# Altium schematic sheet Bus-switch.SchDoc
size B
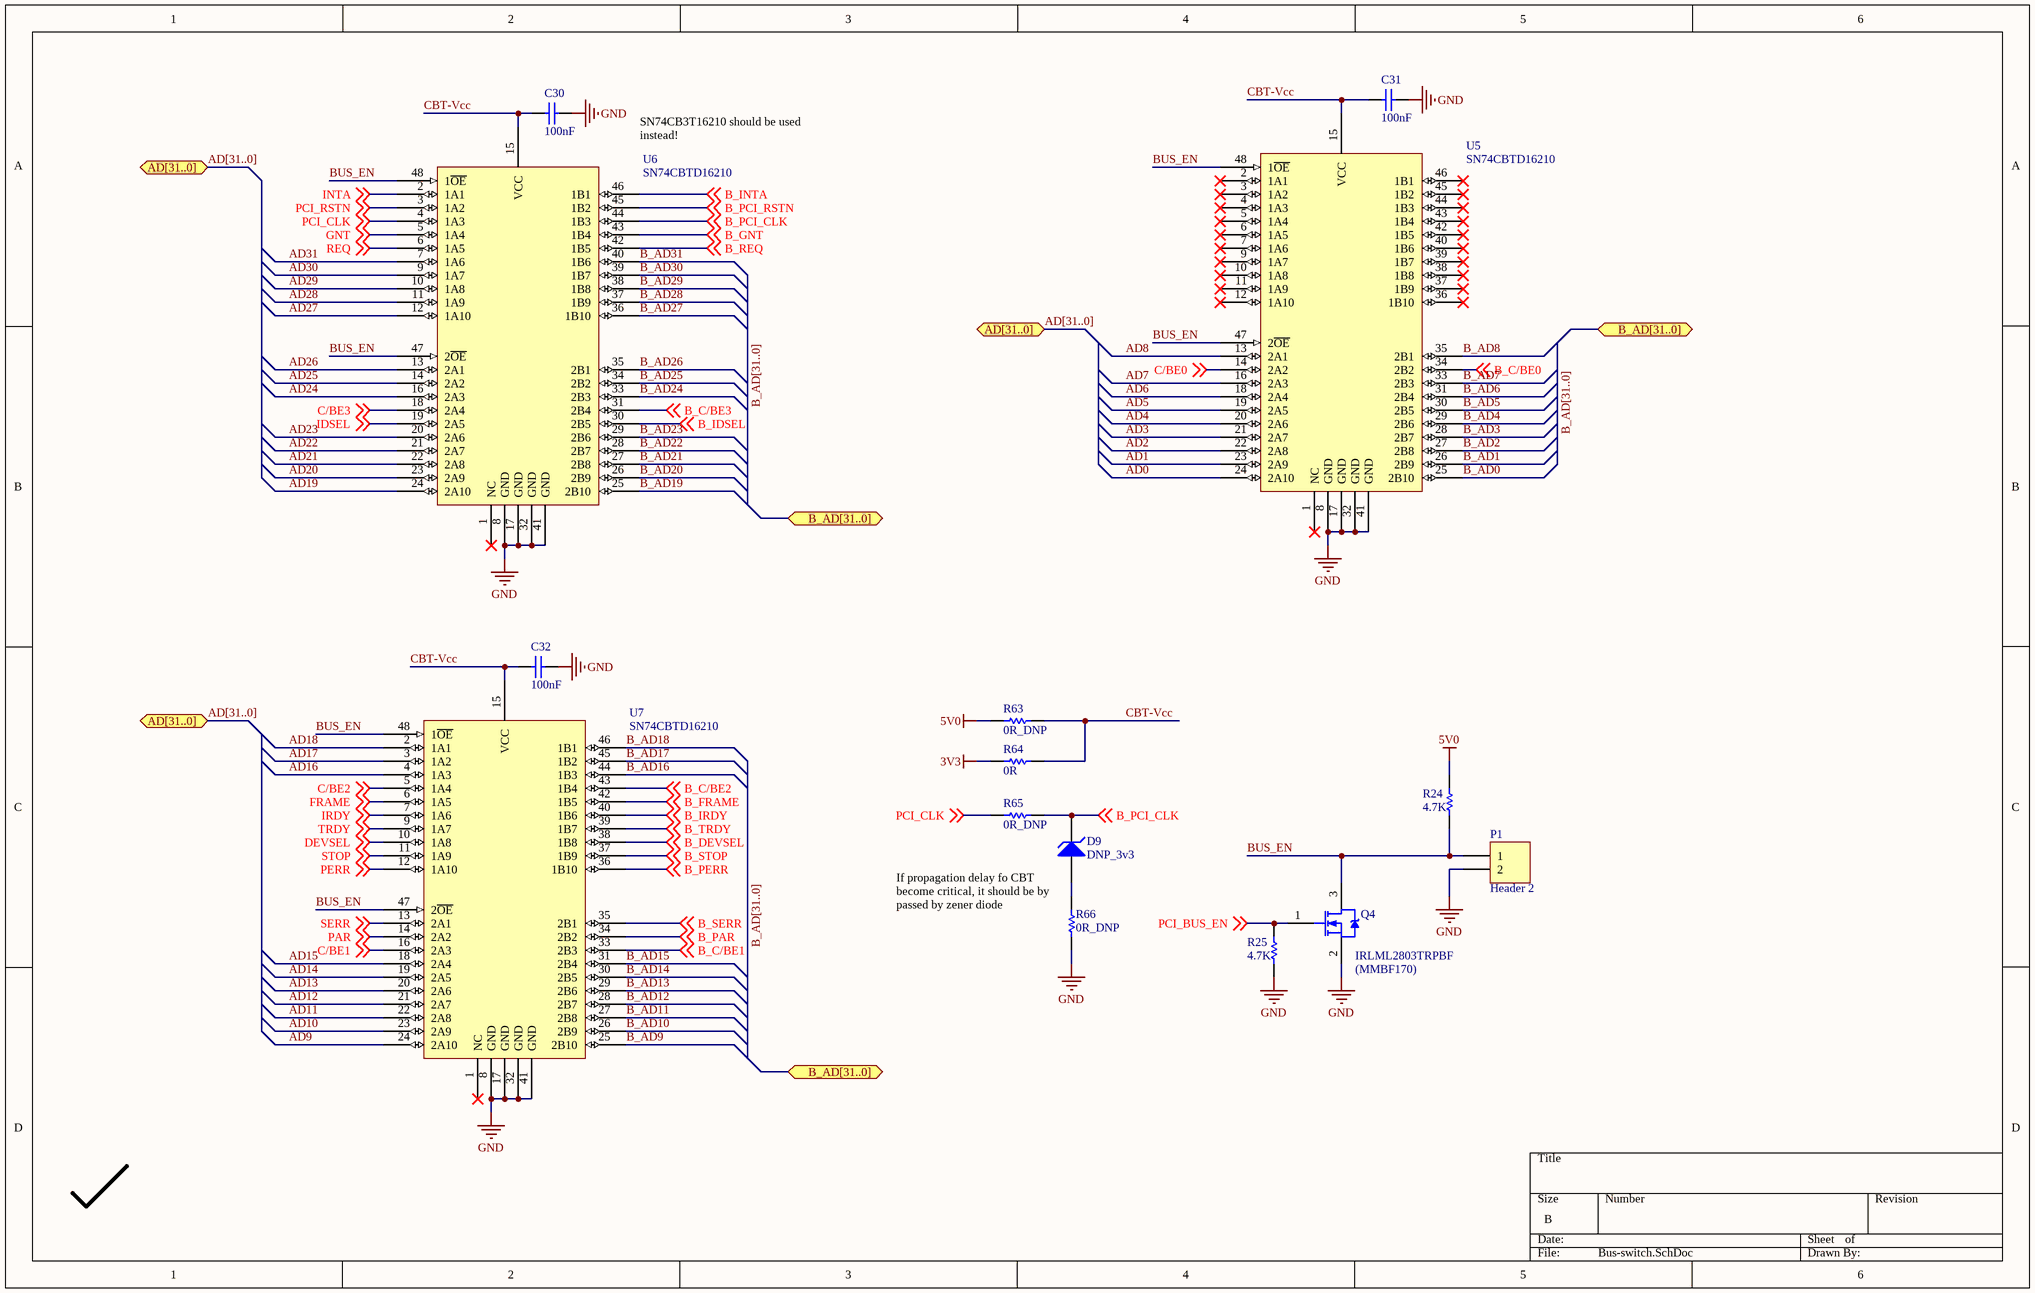
[diagram p0: Bus-switch.SchDoc]

## Parts
C30  value 100nF  [0603PKG]  (hidden comment: Cap Semi)
C31  value 100nF  [0603PKG]  (hidden comment: Cap Semi)
C32  value 100nF  [0603PKG]  (hidden comment: Cap Semi)
D9  DNP_3v3  [C1206]
P1  Header 2  [HDR1X2]
Q4  IRLML2803TRPBF  [SOT23]
R24  value 4.7K  [0603PKG]  (hidden comment: Res1)
R25  value 4.7K  [0603PKG]  (hidden comment: Res1)
R63  value 0R_DNP  [0603PKG]  (hidden comment: Res1)
R64  value 0R  [0603PKG]  (hidden comment: Res1)
R65  value 0R_DNP  [0603PKG]  (hidden comment: Res1)
R66  value 0R_DNP  [0603PKG]  (hidden comment: Res1)
U5  SN74CBTD16210  [TSSOP-48-DGG]
U6  SN74CBTD16210  [TSSOP-48-DGG]
U7  SN74CBTD16210  [TSSOP-48-DGG]

## Ports
AD[31..0], B_AD[31..0]

## Nets
3V3: R64.2
5V0: R24.2 R63.2
GND: C30.1 C31.1 C32.1 P1.2 Q4.2(S) R25.1 R66.2 U5.8(GND) U5.17(GND) U5.32(GND) U5.41(GND) U6.8(GND) U6.17(GND) U6.32(GND) U6.41(GND) U7.8(GND) U7.17(GND) U7.32(GND) U7.41(GND)
AD0: U5.24(2A10)
AD1: U5.23(2A9)
AD2: U5.22(2A8)
AD3: U5.21(2A7)
AD4: U5.20(2A6)
AD5: U5.19(2A5)
AD6: U5.18(2A4)
AD7: U5.16(2A3)
AD8: U5.13(2A1)
AD9: U7.24(2A10)
AD10: U7.23(2A9)
AD11: U7.22(2A8)
AD12: U7.21(2A7)
AD13: U7.20(2A6)
AD14: U7.19(2A5)
AD15: U7.18(2A4)
AD16: U7.4(1A3)
AD17: U7.3(1A2)
AD18: U7.2(1A1)
AD19: U6.24(2A10)
AD20: U6.23(2A9)
AD21: U6.22(2A8)
AD22: U6.21(2A7)
AD23: U6.20(2A6)
AD24: U6.16(2A3)
AD25: U6.14(2A2)
AD26: U6.13(2A1)
AD27: U6.12(1A10)
AD28: U6.11(1A9)
AD29: U6.10(1A8)
AD30: U6.9(1A7)
AD31: U6.7(1A6)
B_AD0: U5.25(2B10)
B_AD1: U5.26(2B9)
B_AD2: U5.27(2B8)
B_AD3: U5.28(2B7)
B_AD4: U5.29(2B6)
B_AD5: U5.30(2B5)
B_AD6: U5.31(2B4)
B_AD7: U5.33(2B3)
B_AD8: U5.35(2B1)
B_AD9: U7.25(2B10)
B_AD10: U7.26(2B9)
B_AD11: U7.27(2B8)
B_AD12: U7.28(2B7)
B_AD13: U7.29(2B6)
B_AD14: U7.30(2B5)
B_AD15: U7.31(2B4)
B_AD16: U7.44(1B3)
B_AD17: U7.45(1B2)
B_AD18: U7.46(1B1)
B_AD19: U6.25(2B10)
B_AD20: U6.26(2B9)
B_AD21: U6.27(2B8)
B_AD22: U6.28(2B7)
B_AD23: U6.29(2B6)
B_AD24: U6.33(2B3)
B_AD25: U6.34(2B2)
B_AD26: U6.35(2B1)
B_AD27: U6.36(1B10)
B_AD28: U6.37(1B9)
B_AD29: U6.38(1B8)
B_AD30: U6.39(1B7)
B_AD31: U6.40(1B6)
B_C/BE0: U5.34(2B2) ; off-sheet B_C/BE0
B_C/BE1: U7.33(2B3) ; off-sheet B_C/BE1
B_C/BE2: U7.43(1B4) ; off-sheet B_C/BE2
B_C/BE3: U6.31(2B4) ; off-sheet B_C/BE3
B_DEVSEL: U7.38(1B8) ; off-sheet B_DEVSEL
B_FRAME: U7.42(1B5) ; off-sheet B_FRAME
B_GNT: U6.43(1B4) ; off-sheet B_GNT
B_IDSEL: U6.30(2B5) ; off-sheet B_IDSEL
B_INTA: U6.46(1B1) ; off-sheet B_INTA
B_IRDY: U7.40(1B6) ; off-sheet B_IRDY
B_PAR: U7.34(2B2) ; off-sheet B_PAR
B_PCI_CLK: D9.2(K) R65.1 U6.44(1B3) ; off-sheet B_PCI_CLK
B_PCI_RSTN: U6.45(1B2) ; off-sheet B_PCI_RSTN
B_PERR: U7.36(1B10) ; off-sheet B_PERR
B_REQ: U6.42(1B5) ; off-sheet B_REQ
B_SERR: U7.35(2B1) ; off-sheet B_SERR
B_STOP: U7.37(1B9) ; off-sheet B_STOP
B_TRDY: U7.39(1B7) ; off-sheet B_TRDY
BUS_EN: P1.1 Q4.3(D) R24.1 U5.47(2~{OE}) U5.48(1~{OE}) U6.47(2~{OE}) U6.48(1~{OE}) U7.47(2~{OE}) U7.48(1~{OE})
C/BE0: U5.14(2A2) ; off-sheet C/BE0
C/BE1: U7.16(2A3) ; off-sheet C/BE1
C/BE2: U7.5(1A4) ; off-sheet C/BE2
C/BE3: U6.18(2A4) ; off-sheet C/BE3
CBT-Vcc: C30.2 C31.2 C32.2 R63.1 R64.1 U5.15(VCC) U6.15(VCC) U7.15(VCC)
DEVSEL: U7.10(1A8) ; off-sheet DEVSEL
FRAME: U7.6(1A5) ; off-sheet FRAME
GNT: U6.5(1A4) ; off-sheet GNT
IDSEL: U6.19(2A5) ; off-sheet IDSEL
INTA: U6.2(1A1) ; off-sheet INTA
IRDY: U7.7(1A6) ; off-sheet IRDY
PAR: U7.14(2A2) ; off-sheet PAR
PCI_BUS_EN: Q4.1(G) R25.2 ; off-sheet PCI_BUS_EN
PCI_CLK: R65.2 U6.4(1A3) ; off-sheet PCI_CLK
PCI_RSTN: U6.3(1A2) ; off-sheet PCI_RSTN
PERR: U7.12(1A10) ; off-sheet PERR
REQ: U6.6(1A5) ; off-sheet REQ
SERR: U7.13(2A1) ; off-sheet SERR
STOP: U7.11(1A9) ; off-sheet STOP
TRDY: U7.9(1A7) ; off-sheet TRDY
NetD9_1: D9.1(A) R66.1

Not connected (* = marked no-connect by the designer): U5 1(NC)* 2(1A1)* 3(1A2)* 4(1A3)* 5(1A4)* 6(1A5)* 7(1A6)* 9(1A7)* 10(1A8)* 11(1A9)* 12(1A10)* 36(1B10)* 37(1B9)* 38(1B8)* 39(1B7)* 40(1B6)* 42(1B5)* 43(1B4)* 44(1B3)* 45(1B2)* 46(1B1)*; U6 1(NC)*; U7 1(NC)*

## Buses and harness runs
bus AD[31..0] = port AD[31..0]
bus B_AD[31..0] = port B_AD[31..0]

## Notes on the sheet
- (near U6) SN74CB3T16210 should be used instead!
- If propagation delay fo CBT become critical, it should be by passed by zener diode
- (near Q4) (MMBF170)

## Library data of the parts
C30-C32 = Cap Semi: Capacitor (Semiconductor SIM Model); Published: 8-Jun-2000; LatestRevisionDate: 29-May-2009; LatestRevisionNote: IPC-7351 Footprint Added.; PackageReference: C1206; Publisher: Altium Limited; PackageDescription: Chip Capacitor
D9 = D Zener: Zener Diode; Published: 8-Jun-2000; LatestRevisionDate: 17-Jul-2002; LatestRevisionNote: Re-released for DXP Platform.; PackageReference: DIODE-0.7; Publisher: Altium Limited; PackageDescription: Diode, Thru-Hole; 2 Leads; 0.7 in Pin Spacing
P1 = Header 2: Header, 2-Pin; LatestRevisionDate: 17-Jul-2002; LatestRevisionNote: Re-released for DXP Platform.; Publisher: Altium Limited
Q4 = NMOS-2: N-Channel Power MOSFET; Note: Pin 2 is electrically connected to pin 4.; Published: 8-Jun-2000; LatestRevisionDate: 17-Jul-2002; LatestRevisionNote: Re-released for DXP Platform.; DatasheetVersion: PD-9.814; PackageVersion: Feb-1997; PackageReference: TO-220AB; Publisher: Altium Limited; PackageDescription: TO, Thru-Hole, Vertical, Heatsink Mounted; 3 In-Line Leads; Pitch 2.54 mm; ComponentLink1Description: Manufacturer Link; ComponentLink1URL: http://www.irf.com/
R24 R25 R63-R66 = Res1: Resistor; Published: 8-Jun-2000; LatestRevisionDate: 17-Jul-2002; LatestRevisionNote: Re-released for DXP Platform.; PackageReference: AXIAL-0.3; Publisher: Altium Limited; PackageDescription: Axial Device, Thru-Hole; 2 Leads; 0.3 in Pin Spacing
U5-U7 = SN74CBTD16210: 20-BIT FET BUS SWITCH WITH LEVEL SHIFTING